# Altium schematic sheet Micro.SchDoc
size A4
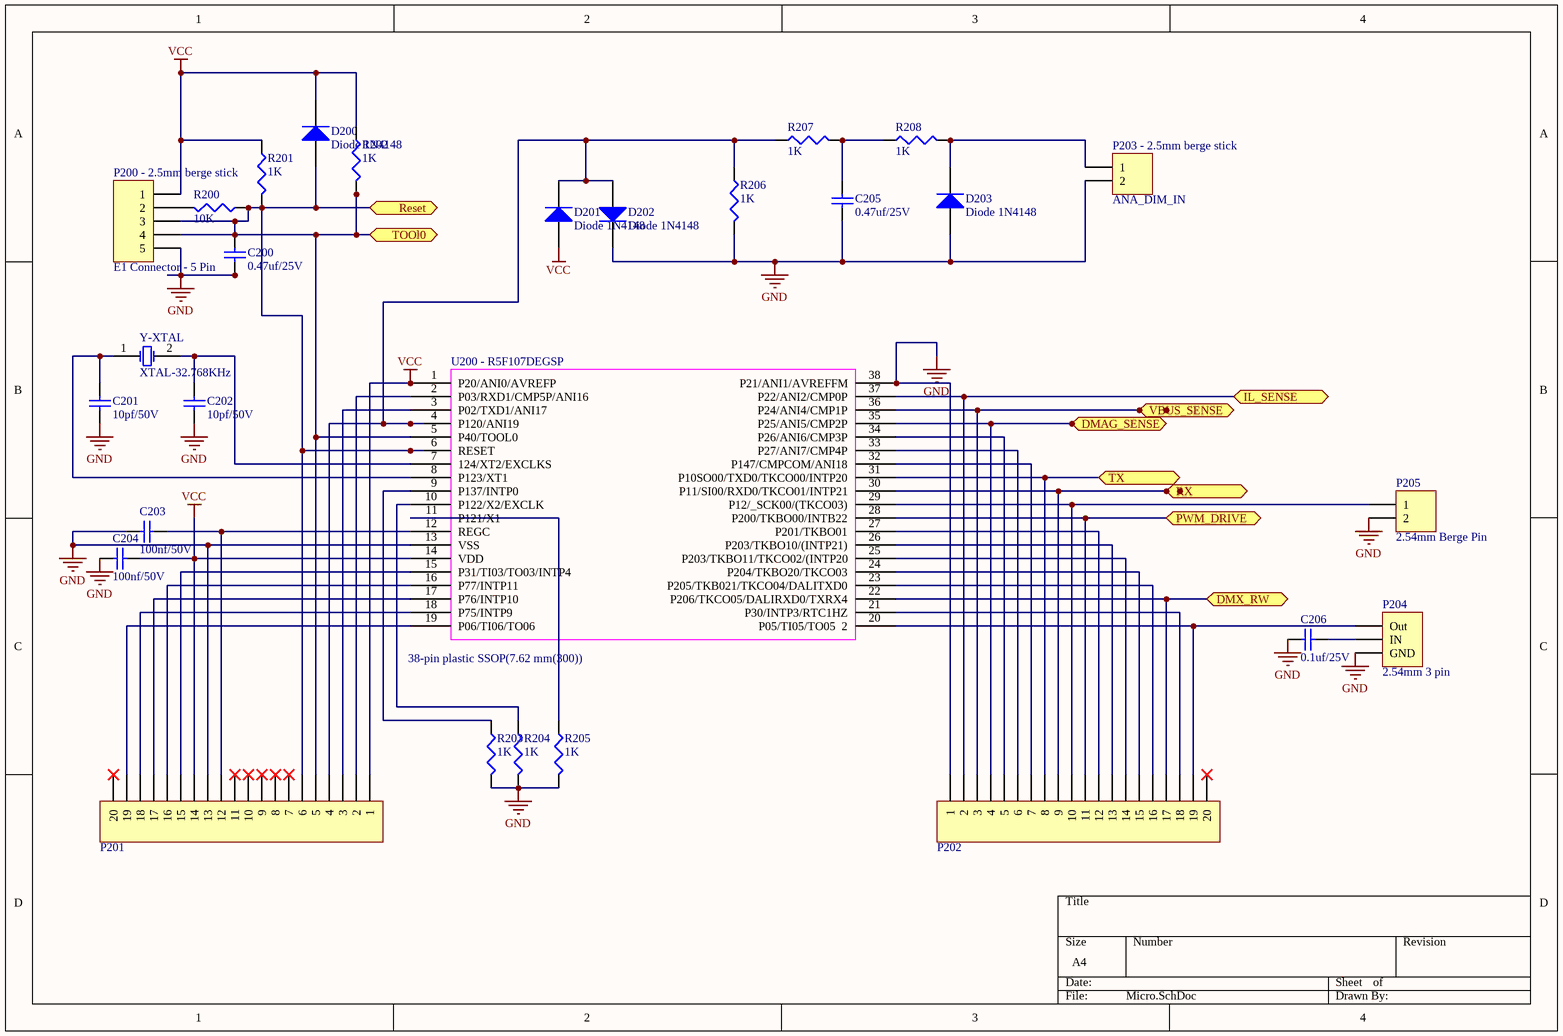
[diagram p0: Micro.SchDoc]

## Parts
C200  0.47uf/25V  [CC3225-1210]
C201  10pf/50V  [CC3225-1210]
C202  10pf/50V  [CC3225-1210]
C203  100nf/50V  [CC3225-1210]
C204  100nf/50V  [CC3225-1210]
C205  0.47uf/25V  [CC3225-1210]
C206  0.1uf/25V  [CC3225-1210]
D200  Diode 1N4148  [DO-35]
D201  Diode 1N4148  [DO-35]
D202  Diode 1N4148  [DO-35]
D203  Diode 1N4148  [DO-35]
P200_-_2.5mm_berge_stick  E1 Connector - 5 Pin  [HDR1X5]
P201  20 pin 2.5 mm berge stick  [HDR1X20]  (value not drawn)
P202  20 pin 2.5mm berge stick  [HDR1X20]  (value not drawn)
P203_-_2.5mm_berge_stick  ANA_DIM_IN  [HDR1X2]
P204  2.54mm 3 pin  [HDR1X3]
P205  2.54mm Berge Pin  [HDR1X2]
R200  value 10K  [CR2012-0805]  (hidden comment: CR2012-0805)
R201  value 1K  [CR2012-0805]  (hidden comment: CR2012-0805)
R202  value 1K  [CR2012-0805]  (hidden comment: CR2012-0805)
R203  value 1K  [CR2012-0805]  (hidden comment: CR2012-0805)
R204  value 1K  [CR2012-0805]  (hidden comment: CR2012-0805)
R205  value 1K  [CR2012-0805]  (hidden comment: CR2012-0805)
R206  value 1K  [CR2012-0805]  (hidden comment: CR2012-0805)
R207  value 1K  [CR2012-0805]  (hidden comment: CR2012-0805)
R208  value 1K  [CR2012-0805]  (hidden comment: CR2012-0805)
U200_-_R5F107DEGSP  38-pin plastic SSOP(7.62 mm(300))
Y-XTAL  XTAL-32.768KHz  [XI-11.1X4.68X3.51mm]

## Ports
DMAG_SENSE, DMX_RW, IL_SENSE, PWM_DRIVE, Reset, RX, TOOl0, TX, VBUS_SENSE

## Nets
GND: C200.1 C201.1 C202.1 C203.2 C204.2 C205.1 C206.2 D202.2(K) D203.1(A) P200_-_2.5mm_berge_stick.5 P201.13 P202.1 P203_-_2.5mm_berge_stick.2 P204.3(GND) P205.2 R203.2 R204.2 R205.2 R206.2 U200_-_R5F107DEGSP.13(VSS) U200_-_R5F107DEGSP.38(P21/ANI1/AVREFFM)
VCC: C204.1 D200.2(K) D201.1(A) P200_-_2.5mm_berge_stick.1 P201.1 P201.14 R201.1 R202.1 U200_-_R5F107DEGSP.1(P20/ANI0/AVREFP) U200_-_R5F107DEGSP.14(VDD)
DMAG_SENSE: P202.4 U200_-_R5F107DEGSP.35(P25/ANI5/CMP2P) ; port DMAG_SENSE
DMX_RW: P202.17 U200_-_R5F107DEGSP.22(P206/TKCO05/DALIRXD0/TXRX4) ; port DMX_RW
IL_SENSE: P202.2 U200_-_R5F107DEGSP.37(P22/ANI2/CMP0P) ; port IL_SENSE
PWM_DRIVE: P202.11 U200_-_R5F107DEGSP.28(P200/TKBO00/INTB22) ; port PWM_DRIVE
Reset: C200.2 D200.1(A) P200_-_2.5mm_berge_stick.3 P200_-_2.5mm_berge_stick.4 P201.5 P201.6 R200.1 R201.2 R202.2 U200_-_R5F107DEGSP.5(P40/TOOL0) U200_-_R5F107DEGSP.6(RESET) ; port Reset, port TOOl0
RX: P202.9 U200_-_R5F107DEGSP.30(P11/SI00/RXD0/TKCO01/INTP21) ; port RX
TX: P202.8 U200_-_R5F107DEGSP.31(P10SO00/TXD0/TKCO00/INTP20) ; port TX
VBUS_SENSE: P202.3 U200_-_R5F107DEGSP.36(P24/ANI4/CMP1P) ; port VBUS_SENSE
NetC201_2: C201.2 U200_-_R5F107DEGSP.8(P123/XT1) Y-XTAL.1(OSC1)
NetC202_2: C202.2 U200_-_R5F107DEGSP.7(124/XT2/EXCLKS) Y-XTAL.2(OSC2)
NetC203_1: C203.1 P201.12 U200_-_R5F107DEGSP.12(REGC)
NetC205_2: C205.2 R207.2 R208.1
NetC206_1: C206.1 P204.2(IN)
NetD201_2: D201.2(K) D202.1(A) P201.4 R206.1 R207.1 U200_-_R5F107DEGSP.4(P120/ANI19)
NetD203_2: D203.2(K) P203_-_2.5mm_berge_stick.1 R208.2
NetP200_-_2.5mm_berge_stick_2: P200_-_2.5mm_berge_stick.2 R200.2
NetP201_2: P201.2 U200_-_R5F107DEGSP.2(P03/RXD1/CMP5P/ANI16)
NetP201_3: P201.3 U200_-_R5F107DEGSP.3(P02/TXD1/ANI17)
NetP201_15: P201.15 U200_-_R5F107DEGSP.15(P31/TI03/TO03/INTP4)
NetP201_16: P201.16 U200_-_R5F107DEGSP.16(P77/INTP11)
NetP201_17: P201.17 U200_-_R5F107DEGSP.17(P76/INTP10)
NetP201_18: P201.18 U200_-_R5F107DEGSP.18(P75/INTP9)
NetP201_19: P201.19 U200_-_R5F107DEGSP.19(P06/TI06/TO06)
NetP202_5: P202.5 U200_-_R5F107DEGSP.34(P26/ANI6/CMP3P)
NetP202_6: P202.6 U200_-_R5F107DEGSP.33(P27/ANI7/CMP4P)
NetP202_7: P202.7 U200_-_R5F107DEGSP.32(P147/CMPCOM/ANI18)
NetP202_10: P202.10 P205.1 U200_-_R5F107DEGSP.29(P12/_SCK00/(TKCO03))
NetP202_12: P202.12 U200_-_R5F107DEGSP.27(P201/TKBO01)
NetP202_13: P202.13 U200_-_R5F107DEGSP.26(P203/TKBO10/(INTP21))
NetP202_14: P202.14 U200_-_R5F107DEGSP.25(P203/TKBO11/TKCO02/(INTP20)
NetP202_15: P202.15 U200_-_R5F107DEGSP.24(P204/TKBO20/TKCO03)
NetP202_16: P202.16 U200_-_R5F107DEGSP.23(P205/TKB021/TKCO04/DALITXD0)
NetP202_18: P202.18 U200_-_R5F107DEGSP.21(P30/INTP3/RTC1HZ)
NetP202_19: P202.19 P204.1(Out) U200_-_R5F107DEGSP.20(P05/TI05/TO05__2)
NetR203_1: R203.1 U200_-_R5F107DEGSP.9(P137/INTP0)
NetR204_1: R204.1 U200_-_R5F107DEGSP.10(P122/X2/EXCLK)
NetR205_1: R205.1 U200_-_R5F107DEGSP.11(P121/X1)

Not connected (* = marked no-connect by the designer): P201 7* 8* 9* 10* 11* 20*; P202 20*

## Library data of the parts
C200 C205 = Cap: Capacitor; Value: 0.47uf; Published: 8-Jun-2000; LatestRevisionDate: 17-Jul-2002; LatestRevisionNote: Re-released for DXP Platform.; PackageReference: RAD-0.3; Publisher: Altium Limited; PackageDescription: Radial Cap, Thru-Hole; 2 Leads; 0.3 in Pin Spacing
C201 C202 = Cap: Capacitor; Value: 10pf; Published: 8-Jun-2000; LatestRevisionDate: 17-Jul-2002; LatestRevisionNote: Re-released for DXP Platform.; PackageReference: RAD-0.3; Publisher: Altium Limited; PackageDescription: Radial Cap, Thru-Hole; 2 Leads; 0.3 in Pin Spacing
C203 C204 = Cap: Capacitor; Value: 100nf; Published: 8-Jun-2000; LatestRevisionDate: 17-Jul-2002; LatestRevisionNote: Re-released for DXP Platform.; PackageReference: RAD-0.3; Publisher: Altium Limited; PackageDescription: Radial Cap, Thru-Hole; 2 Leads; 0.3 in Pin Spacing
C206 = Cap: Capacitor; Value: 0.1uf; Published: 8-Jun-2000; LatestRevisionDate: 17-Jul-2002; LatestRevisionNote: Re-released for DXP Platform.; PackageReference: RAD-0.3; Publisher: Altium Limited; PackageDescription: Radial Cap, Thru-Hole; 2 Leads; 0.3 in Pin Spacing
D200-D203 = Diode 1N4148: High Conductance Fast Diode; Published: 8-Jun-2000; LatestRevisionDate: 17-Jul-2002; LatestRevisionNote: Re-released for DXP Platform.; DatasheetVersion: 1997; PackageReference: DO-35; Publisher: Altium Limited; PackageDescription: Diode, Axial; Body 3.8 x 1.9 mm (LxDia. max), Lead Dia. 0.53 mm (max); Code_JEDEC: DO-204-AH; ComponentLink1Description: Manufacturer Link; ComponentLink1URL: http://www.fairchildsemi.com/; ComponentLink2Description: Datasheet; ComponentLink2URL: http://www.fairchildsemi.com/ds/1N%2F1N4148.pdf
P200_-_2.5mm_berge_stick = Header 5: Header, 5-Pin; LatestRevisionDate: 17-Jul-2002; LatestRevisionNote: Re-released for DXP Platform.; Publisher: Altium Limited
P201 P202 = Header 20: Header, 20-Pin; LatestRevisionDate: 17-Jul-2002; LatestRevisionNote: Re-released for DXP Platform.; Publisher: Altium Limited
P203_-_2.5mm_berge_stick P205 = Header 2: Header, 2-Pin; LatestRevisionDate: 17-Jul-2002; LatestRevisionNote: Re-released for DXP Platform.; Publisher: Altium Limited
P204 = Header 3: Header, 3-Pin; LatestRevisionDate: 17-Jul-2002; LatestRevisionNote: Re-released for DXP Platform.; Publisher: Altium Limited
R200-R208 = Res3: Resistor; Published: 8-Jun-2000; LatestRevisionDate: 29-May-2009; LatestRevisionNote: IPC-7351 Footprint Added.; PackageReference: CR2012-0805; Publisher: Altium Limited; PackageDescription: Chip Resistor
U200_-_R5F107DEGSP = Component_1: Package: 38-pin plastic SSOP(7.62 mm(300))
Y-XTAL = XTAL: Crystal Oscillator; Published: 8-Jun-2000; LatestRevisionDate: 17-Jul-2002; LatestRevisionNote: Re-released for DXP Platform.; PackageReference: R38; Publisher: Altium Limited; PackageDescription: Crystal, Thru-Hole; 2 Leads; Body 3.1 x 8.2 mm (Dia.xH)